# EAGLE schematic STUSB4500_PS (EAGLE 9.5.2)

## Sheet 1 of 4
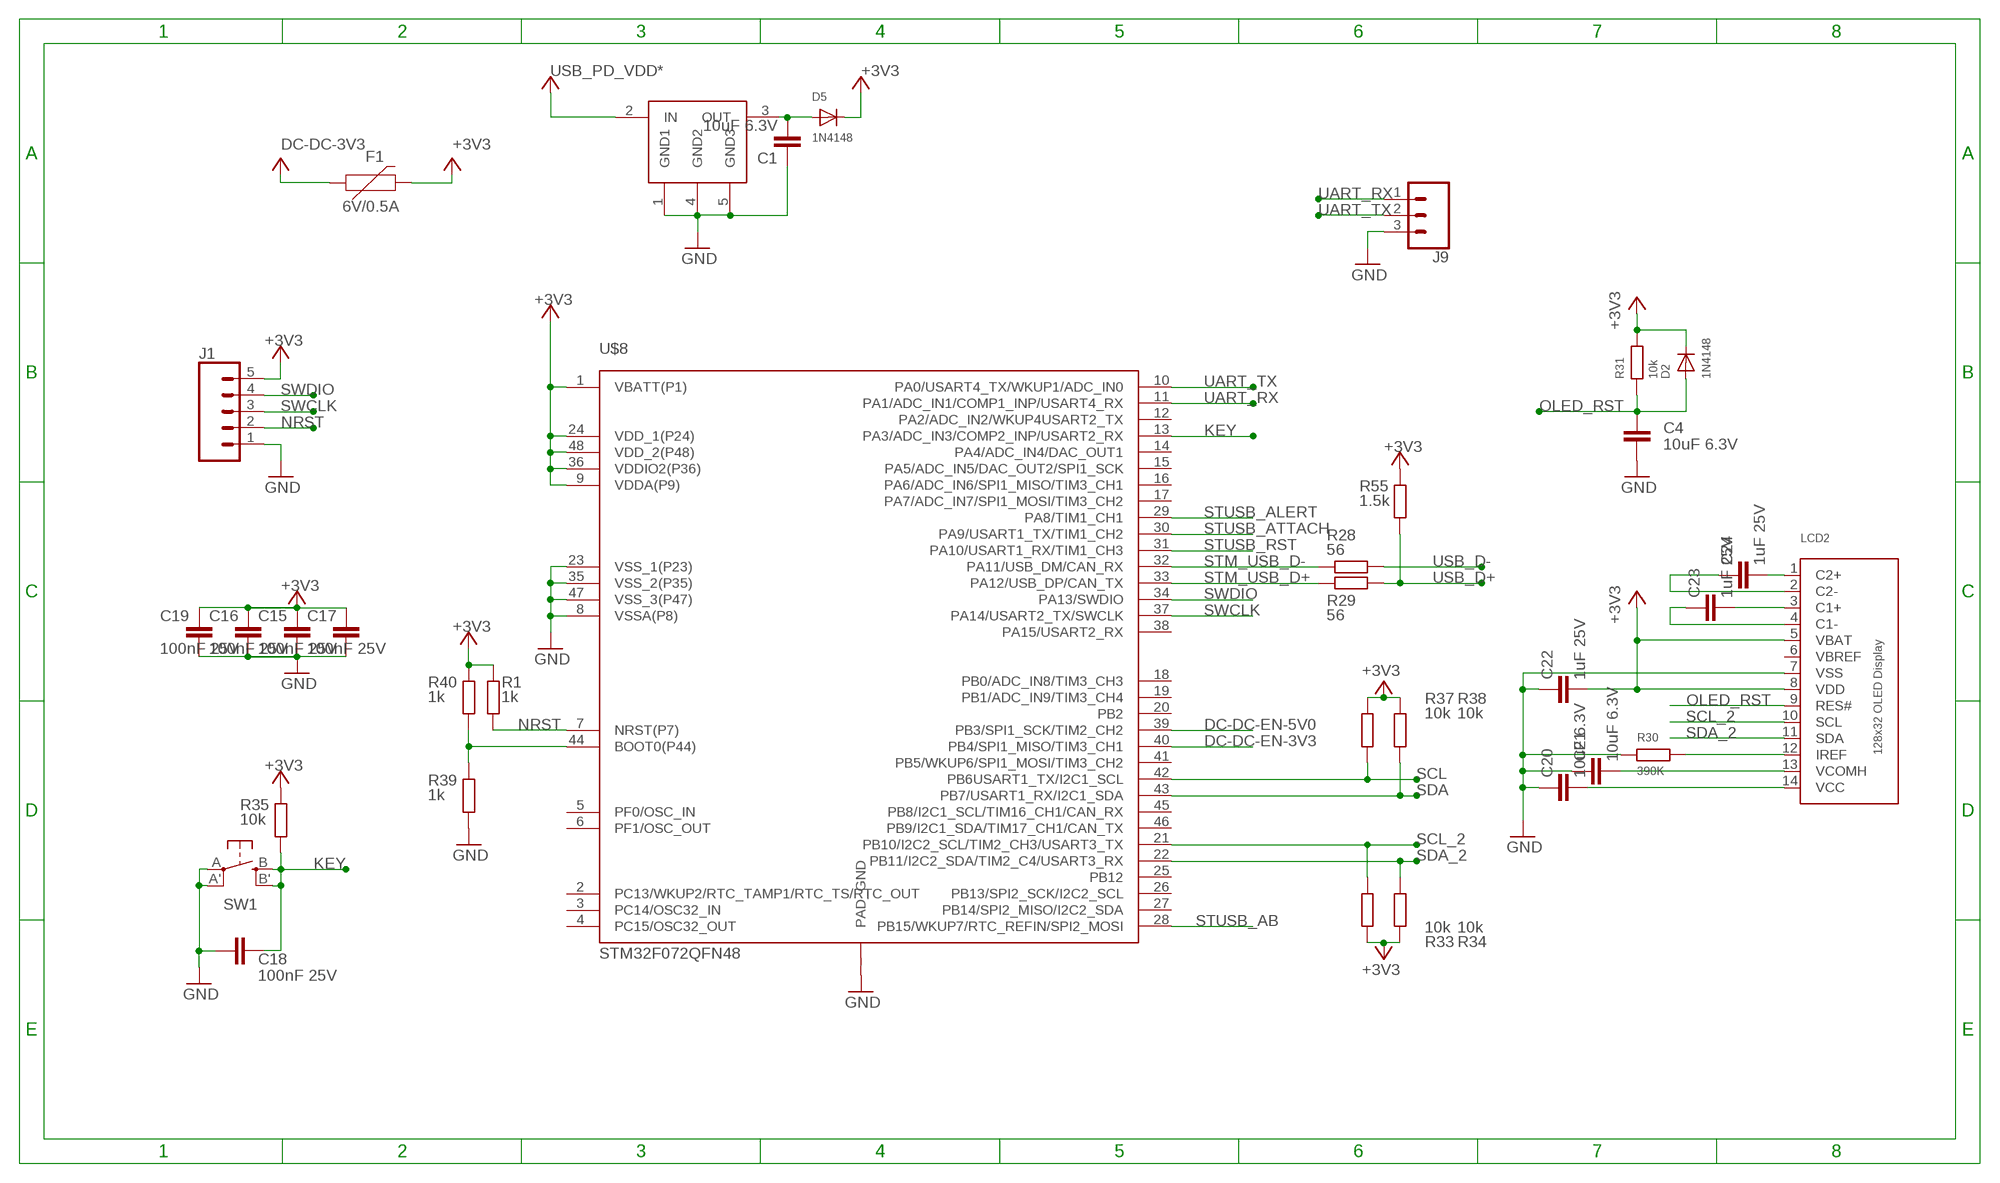
[diagram p0: schematic, sheet 1]

### Parts
C1  10uF 6.3V  C-EUC0603  [C0603]
C4  10uF 6.3V  C-EUC0603  [C0603]
C15  100nF 25V  C-EUC0402  [C0402]
C16  100nF 25V  C-EUC0402  [C0402]
C17  100nF 25V  C-EUC0402  [C0402]
C18  100nF 25V  C-EUC0402  [C0402]
C19  100nF 25V  C-EUC0402  [C0402]
C20  10uF 6.3V  C-EUC0603  [C0603]
C21  10uF 6.3V  C-EUC0603  [C0603]
C22  1uF 25V  C-EUC0603  [C0603]
C23  1uF 25V  C-EUC0603  [C0603]
C24  1uF 25V  C-EUC0603  [C0603]
D2  1N4148  DIODESOD-323F  [SOD-323F]
D5  1N4148  DIODESOD-323F  [SOD-323F]
F1  6V/0.5A  PPTC_HALF-AMP  [1206]
J1  CONN_05LOCK  [1X05_LOCK]
J9  CONN_03LOCK_NO_SILK  [1X03_LOCK_NO_SILK]
LCD2  DISP_OLED_UG-2832HSWEG02  [UG-2832HSWEG02_WRAPUNDER]
R1  1k  R-EU_R0402  [R0402]
R28  56  R-EU_R0402  [R0402]
R29  56  R-EU_R0402  [R0402]
R30  390K  R-EU_R0603  [R0603]
R31  10k  R-EU_R0603  [R0603]
R33  10k  R-EU_R0402  [R0402]
R34  10k  R-EU_R0402  [R0402]
R35  10k  R-EU_R0402  [R0402]
R37  10k  R-EU_R0402  [R0402]
R38  10k  R-EU_R0402  [R0402]
R39  1k  R-EU_R0402  [R0402]
R40  1k  R-EU_R0402  [R0402]
R55  1.5k  R-EU_R0402  [R0402]
SW1  SPST_TACT-EVQQ2  [EVQ-Q2]
U$1  TLV704_3V3SOT23-5  [SOT23-5]
U$8  STM32F072QFN48  [P-HVQFN48-7X7]

### Nets
+3V3: C15.1 C16.1 C17.1 C19.1 C22.2 D2.C D5.C F1.2 J1.5 LCD2.5(VBAT) LCD2.8(VDD) R1.2 R31.2 R33.2 R34.2 R35.2 R37.2 R38.2 R40.2 R55.2 U$8.1(VBATT(P1)) U$8.9(VDDA(P9)) U$8.24(VDD_1(P24)) U$8.36(VDDIO2(P36)) U$8.48(VDD_2(P48)) ; also sheet 2
DC-DC-3V3: F1.1 ; also sheet 2,3
DC-DC-EN-3V3: U$8.40(PB4/SPI1_MISO/TIM3_CH1) ; also sheet 3
DC-DC-EN-5V0: U$8.39(PB3/SPI1_SCK/TIM2_CH2) ; also sheet 3
GND: C1.1 C4.1 C15.2 C16.2 C17.2 C18.1 C19.2 C20.1 C21.1 C22.1 J1.1 J9.3 LCD2.7(VSS) R30.1 R39.1 SW1.A'(P1) SW1.A(P) U$1.1(GND1) U$1.4(GND2) U$1.5(GND3) U$8.8(VSSA(P8)) U$8.23(VSS_1(P23)) U$8.35(VSS_2(P35)) U$8.47(VSS_3(P47)) U$8._(PAD_GND) ; also sheet 2,3,4
KEY: C18.2 R35.1 SW1.B'(S1) SW1.B(S) U$8.13(PA3/ADC_IN3/COMP2_INP/USART2_RX)
N$2: C1.2 D5.A U$1.3(OUT)
N$27: R39.2 R40.1 U$8.44(BOOT0(P44))
N$35: C24.2 LCD2.1(C2+)
N$36: C24.1 LCD2.2(C2-)
N$37: C23.2 LCD2.3(C1+)
N$38: C23.1 LCD2.4(C1-)
N$39: C21.2 LCD2.13(VCOMH)
N$40: LCD2.12(IREF) R30.2
N$41: C20.2 LCD2.14(VCC)
NRST: J1.2 R1.1 U$8.7(NRST(P7))
OLED_RST: C4.2 D2.A LCD2.9(RES#) R31.1
SCL: R37.1 U$8.42(PB6USART1_TX/I2C1_SCL) ; also sheet 4
SCL_2: LCD2.10(SCL) R33.1 U$8.21(PB10/I2C2_SCL/TIM2_CH3/USART3_TX) ; also sheet 2
SDA: R38.1 U$8.43(PB7/USART1_RX/I2C1_SDA) ; also sheet 4
SDA_2: LCD2.11(SDA) R34.1 U$8.22(PB11/I2C2_SDA/TIM2_C4/USART3_RX) ; also sheet 2
STM_USB_D+: R29.1 U$8.33(PA12/USB_DP/CAN_TX)
STM_USB_D-: R28.1 U$8.32(PA11/USB_DM/CAN_RX)
STUSB_AB: U$8.28(PB15/WKUP7/RTC_REFIN/SPI2_MOSI) ; also sheet 4
STUSB_ALERT: U$8.29(PA8/TIM1_CH1) ; also sheet 4
STUSB_ATTACH: U$8.30(PA9/USART1_TX/TIM1_CH2) ; also sheet 4
STUSB_RST: U$8.31(PA10/USART1_RX/TIM1_CH3) ; also sheet 4
SWCLK: J1.3 U$8.37(PA14/USART2_TX/SWCLK)
SWDIO: J1.4 U$8.34(PA13/SWDIO)
UART_RX: J9.1 U$8.11(PA1/ADC_IN1/COMP1_INP/USART4_RX)
UART_TX: J9.2 U$8.10(PA0/USART4_TX/WKUP1/ADC_IN0)
USB_D+: R29.2 R55.1 ; also sheet 4
USB_D-: R28.2 ; also sheet 4
USB_PD_VDD*: U$1.2(IN) ; also sheet 4
Unconnected: U$8.2(PC13/WKUP2/RTC_TAMP1/RTC_TS/RTC_OUT) U$8.3(PC14/OSC32_IN) U$8.4(PC15/OSC32_OUT) U$8.5(PF0/OSC_IN) U$8.6(PF1/OSC_OUT) U$8.12(PA2/ADC_IN2/WKUP4USART2_TX) U$8.14(PA4/ADC_IN4/DAC_OUT1) U$8.15(PA5/ADC_IN5/DAC_OUT2/SPI1_SCK) U$8.16(PA6/ADC_IN6/SPI1_MISO/TIM3_CH1) U$8.17(PA7/ADC_IN7/SPI1_MOSI/TIM3_CH2) U$8.18(PB0/ADC_IN8/TIM3_CH3) U$8.19(PB1/ADC_IN9/TIM3_CH4) U$8.20(PB2) U$8.25(PB12) U$8.26(PB13/SPI2_SCK/I2C2_SCL) U$8.27(PB14/SPI2_MISO/I2C2_SDA) U$8.38(PA15/USART2_RX) U$8.41(PB5/WKUP6/SPI1_MOSI/TIM3_CH2) U$8.45(PB8/I2C1_SCL/TIM16_CH1/CAN_RX) U$8.46(PB9/I2C1_SDA/TIM17_CH1/CAN_TX)

## Sheet 2 of 4
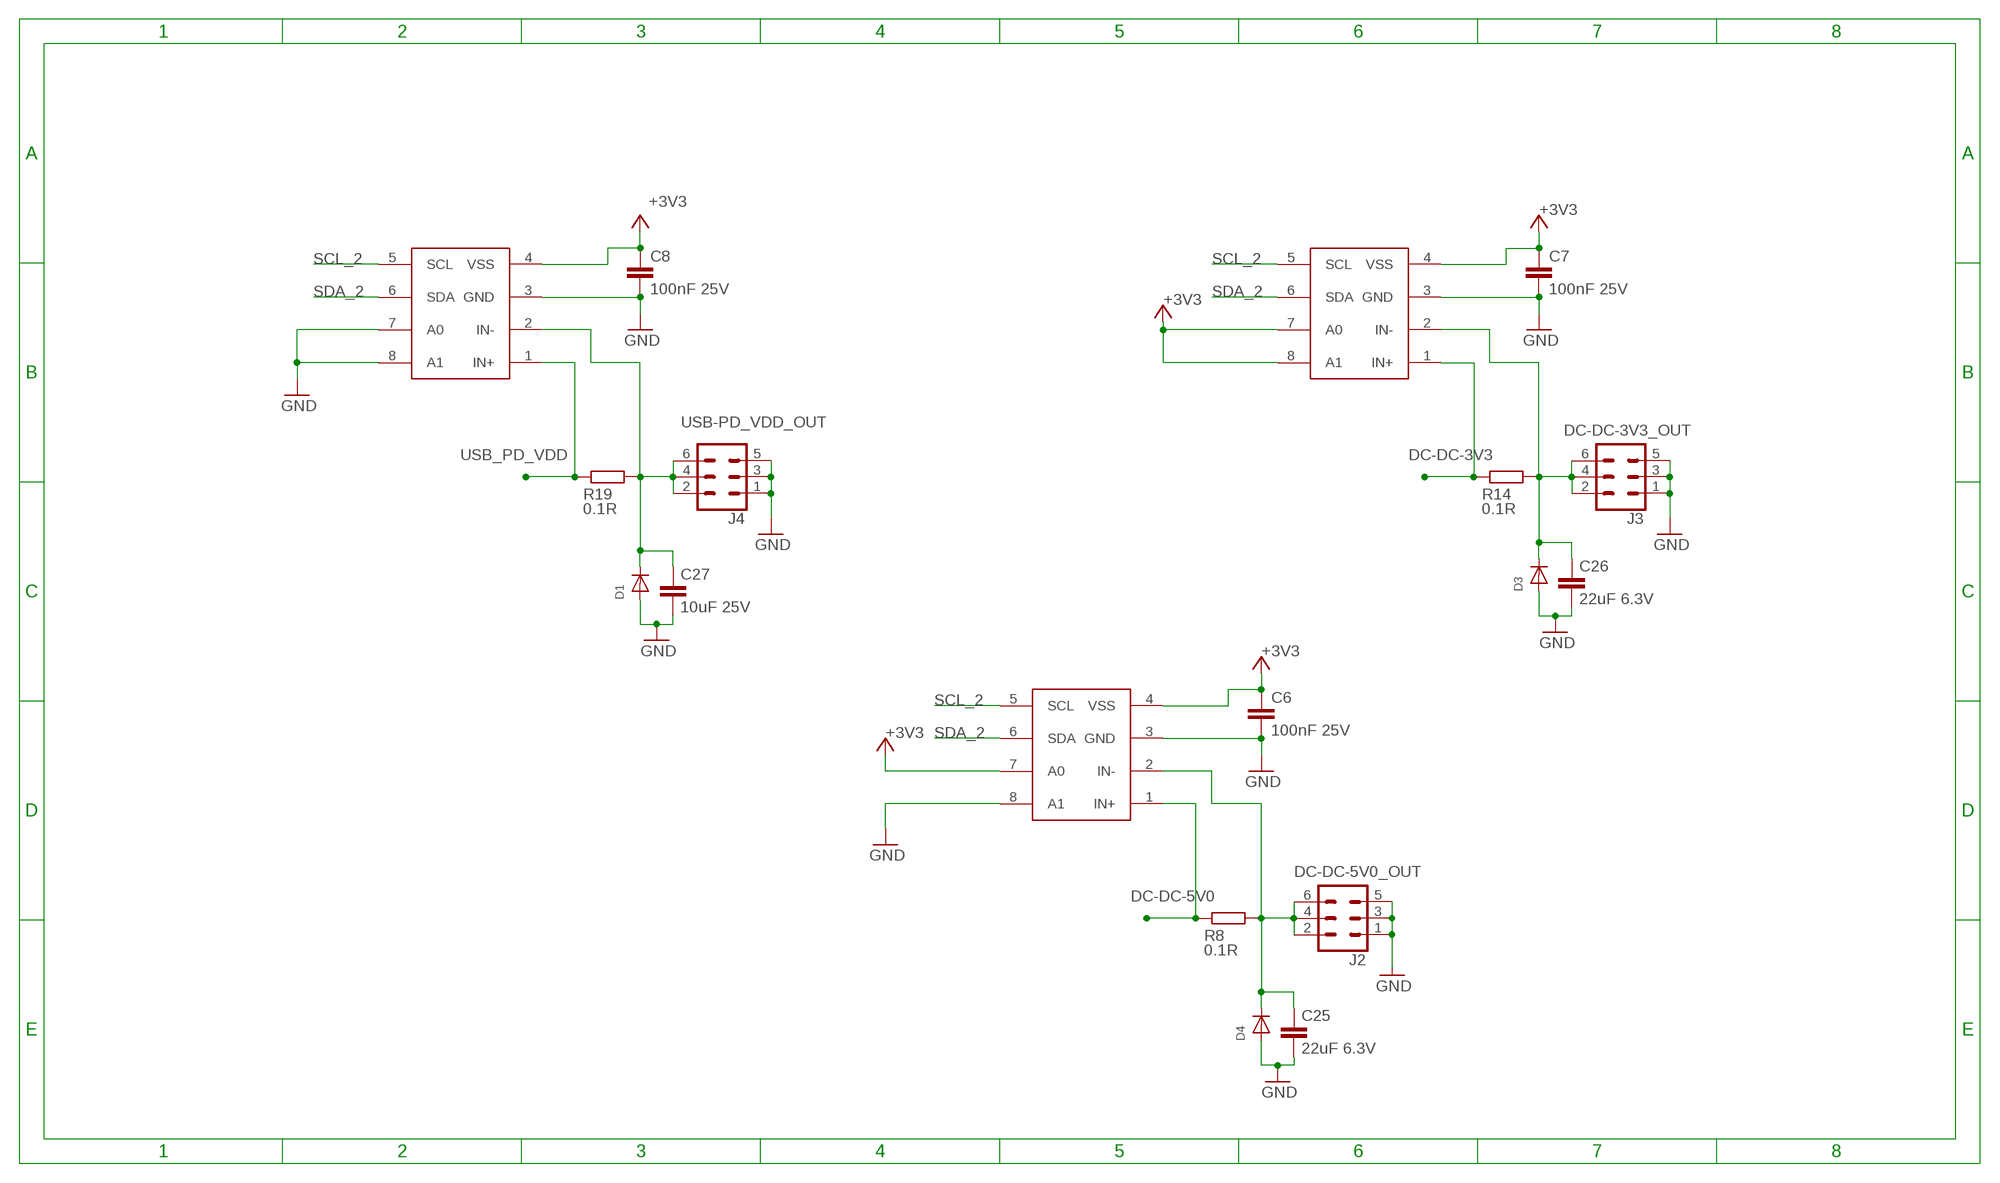
[diagram p1: schematic, sheet 2]

### Parts
C6  100nF 25V  C-EUC0402  [C0402]
C7  100nF 25V  C-EUC0402  [C0402]
C8  100nF 25V  C-EUC0402  [C0402]
C25  22uF 6.3V  C-EUC1206  [C1206]
C26  22uF 6.3V  C-EUC1206  [C1206]
C27  10uF 25V  C-EUC1206  [C1206]
D1  DIODE_SOD-123FL  [SOD-123FL]
D3  DIODE_SOD-123FL  [SOD-123FL]
D4  DIODE_SOD-123FL  [SOD-123FL]
J2  FEMALE 2x3  CONN_03X2NO_SILK  [2X3-NS]
J3  FEMALE 2x3  CONN_03X2NO_SILK  [2X3-NS]
J4  FEMALE 2x3  CONN_03X2NO_SILK  [2X3-NS]
R8  0.1R  R-EU_R2010  [R2010]
R14  0.1R  R-EU_R2010  [R2010]
R19  0.1R  R-EU_R2010  [R2010]
U$7  INA219DCN  [DCN-R-PDSO-G8]
U$9  INA219DCN  [DCN-R-PDSO-G8]
U$10  INA219DCN  [DCN-R-PDSO-G8]

### Nets
+3V3: C6.1 C7.1 C8.1 U$7.4(VSS) U$7.7(A0) U$9.4(VSS) U$9.7(A0) U$9.8(A1) U$10.4(VSS) ; also sheet 1
DC-DC-3V3: R14.2 U$9.1(IN+) ; also sheet 1,3
DC-DC-3V3_OUT: C26.1 D3.C J3.2 J3.4 J3.6 R14.1 U$9.2(IN-)
DC-DC-5V0: R8.2 U$7.1(IN+) ; also sheet 3
DC-DC-5V0_OUT: C25.1 D4.C J2.2 J2.4 J2.6 R8.1 U$7.2(IN-)
GND: C6.2 C7.2 C8.2 C25.2 C26.2 C27.2 D1.A D3.A D4.A J2.1 J2.3 J2.5 J3.1 J3.3 J3.5 J4.1 J4.3 J4.5 U$7.3(GND) U$7.8(A1) U$9.3(GND) U$10.3(GND) U$10.7(A0) U$10.8(A1) ; also sheet 1,3,4
SCL_2: U$7.5(SCL) U$9.5(SCL) U$10.5(SCL) ; also sheet 1
SDA_2: U$7.6(SDA) U$9.6(SDA) U$10.6(SDA) ; also sheet 1
USB-PD_VDD_OUT: C27.1 D1.C J4.2 J4.4 J4.6 R19.1 U$10.2(IN-)
USB_PD_VDD: R19.2 U$10.1(IN+) ; also sheet 3,4

## Sheet 3 of 4
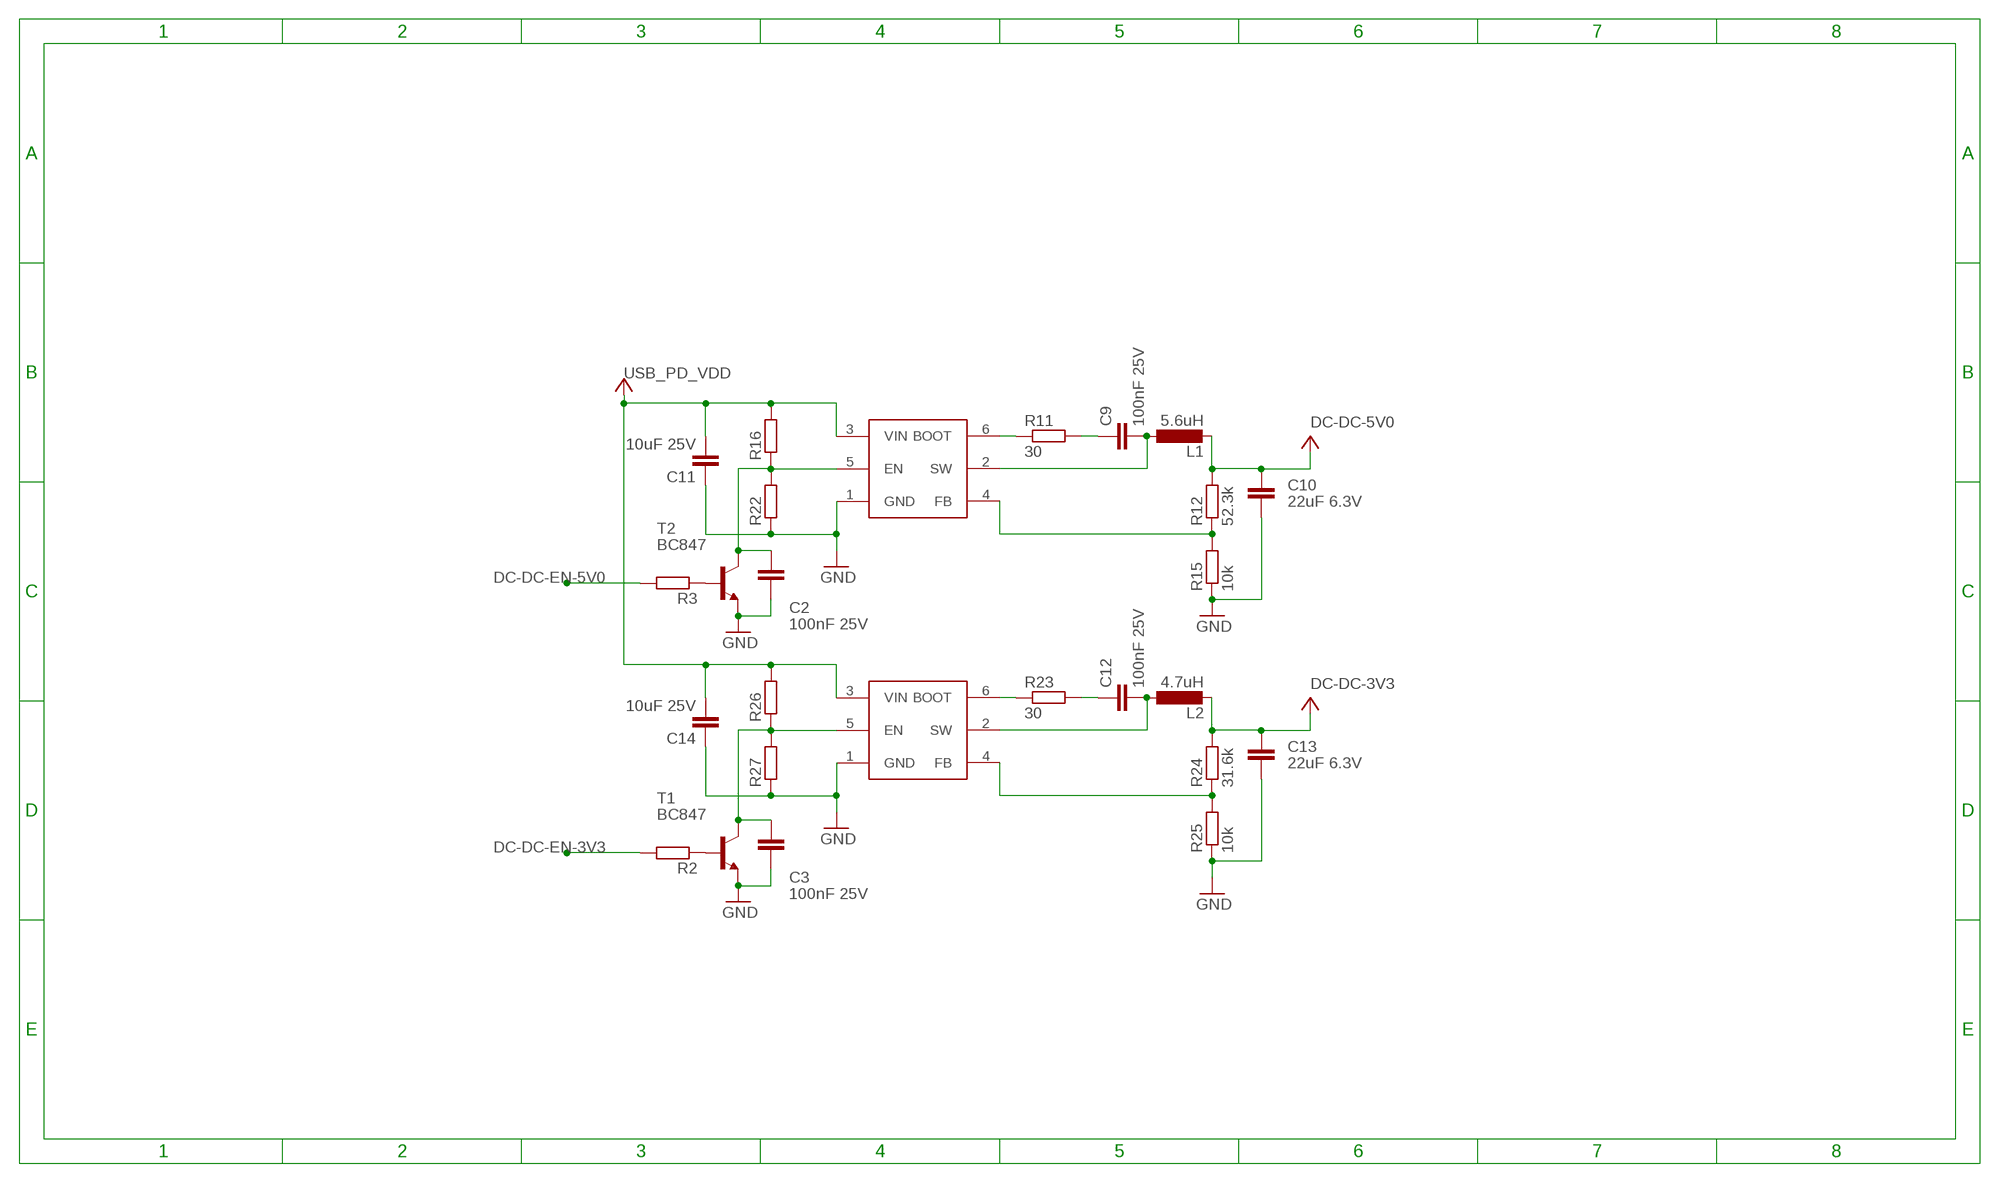
[diagram p2: schematic, sheet 3]

### Parts
C2  100nF 25V  C-EUC0402  [C0402]
C3  100nF 25V  C-EUC0402  [C0402]
C9  100nF 25V  C-EUC0402  [C0402]
C10  22uF 6.3V  C-EUC1206  [C1206]
C11  10uF 25V  C-EUC1206  [C1206]
C12  100nF 25V  C-EUC0402  [C0402]
C13  22uF 6.3V  C-EUC1206  [C1206]
C14  10uF 25V  C-EUC1206  [C1206]
L1  5.6uH  L-EUWE-TPC  [POWER-CHOKE_WE-TPC]
L2  4.7uH  L-EUWE-TPC  [POWER-CHOKE_WE-TPC]
R2  R-EU_R0402  [R0402]
R3  R-EU_R0402  [R0402]
R11  30  R-EU_R0402  [R0402]
R12  52.3k  R-EU_R0603  [R0603]
R15  10k  R-EU_R0603  [R0603]
R16  R-EU_R0402  [R0402]
R22  R-EU_R0402  [R0402]
R23  30  R-EU_R0402  [R0402]
R24  31.6k  R-EU_R0603  [R0603]
R25  10k  R-EU_R0603  [R0603]
R26  R-EU_R0402  [R0402]
R27  R-EU_R0402  [R0402]
T1  BC847  [SOT23]
T2  BC847  [SOT23]
U$11  TPS56339SOT23-6  [TEXAS_SOT23-6]
U$12  TPS56339SOT23-6  [TEXAS_SOT23-6]

### Nets
DC-DC-3V3: C13.2 L2.2 R24.2 ; also sheet 1,2
DC-DC-5V0: C10.2 L1.2 R12.2 ; also sheet 2
DC-DC-EN-3V3: R2.2 ; also sheet 1
DC-DC-EN-5V0: R3.2 ; also sheet 1
GND: C2.1 C3.1 C10.1 C11.1 C13.1 C14.1 R15.1 R22.1 R25.1 R27.1 T1.2(E) T2.2(E) U$11.1(GND) U$12.1(GND) ; also sheet 1,2,4
N$3: R2.1 T1.1(B)
N$5: R3.1 T2.1(B)
N$18: R12.1 R15.2 U$11.4(FB)
N$19: C2.2 R16.1 R22.2 T2.3(C) U$11.5(EN)
N$22: R24.1 R25.2 U$12.4(FB)
N$23: R11.1 U$11.6(BOOT)
N$24: C9.1 R11.2
N$25: C3.2 R26.1 R27.2 T1.3(C) U$12.5(EN)
N$26: C9.2 L1.1 U$11.2(SW)
N$28: R23.1 U$12.6(BOOT)
N$29: C12.1 R23.2
N$30: C12.2 L2.1 U$12.2(SW)
USB_PD_VDD: C11.2 C14.2 R16.2 R26.2 U$11.3(VIN) U$12.3(VIN) ; also sheet 2,4

## Sheet 4 of 4
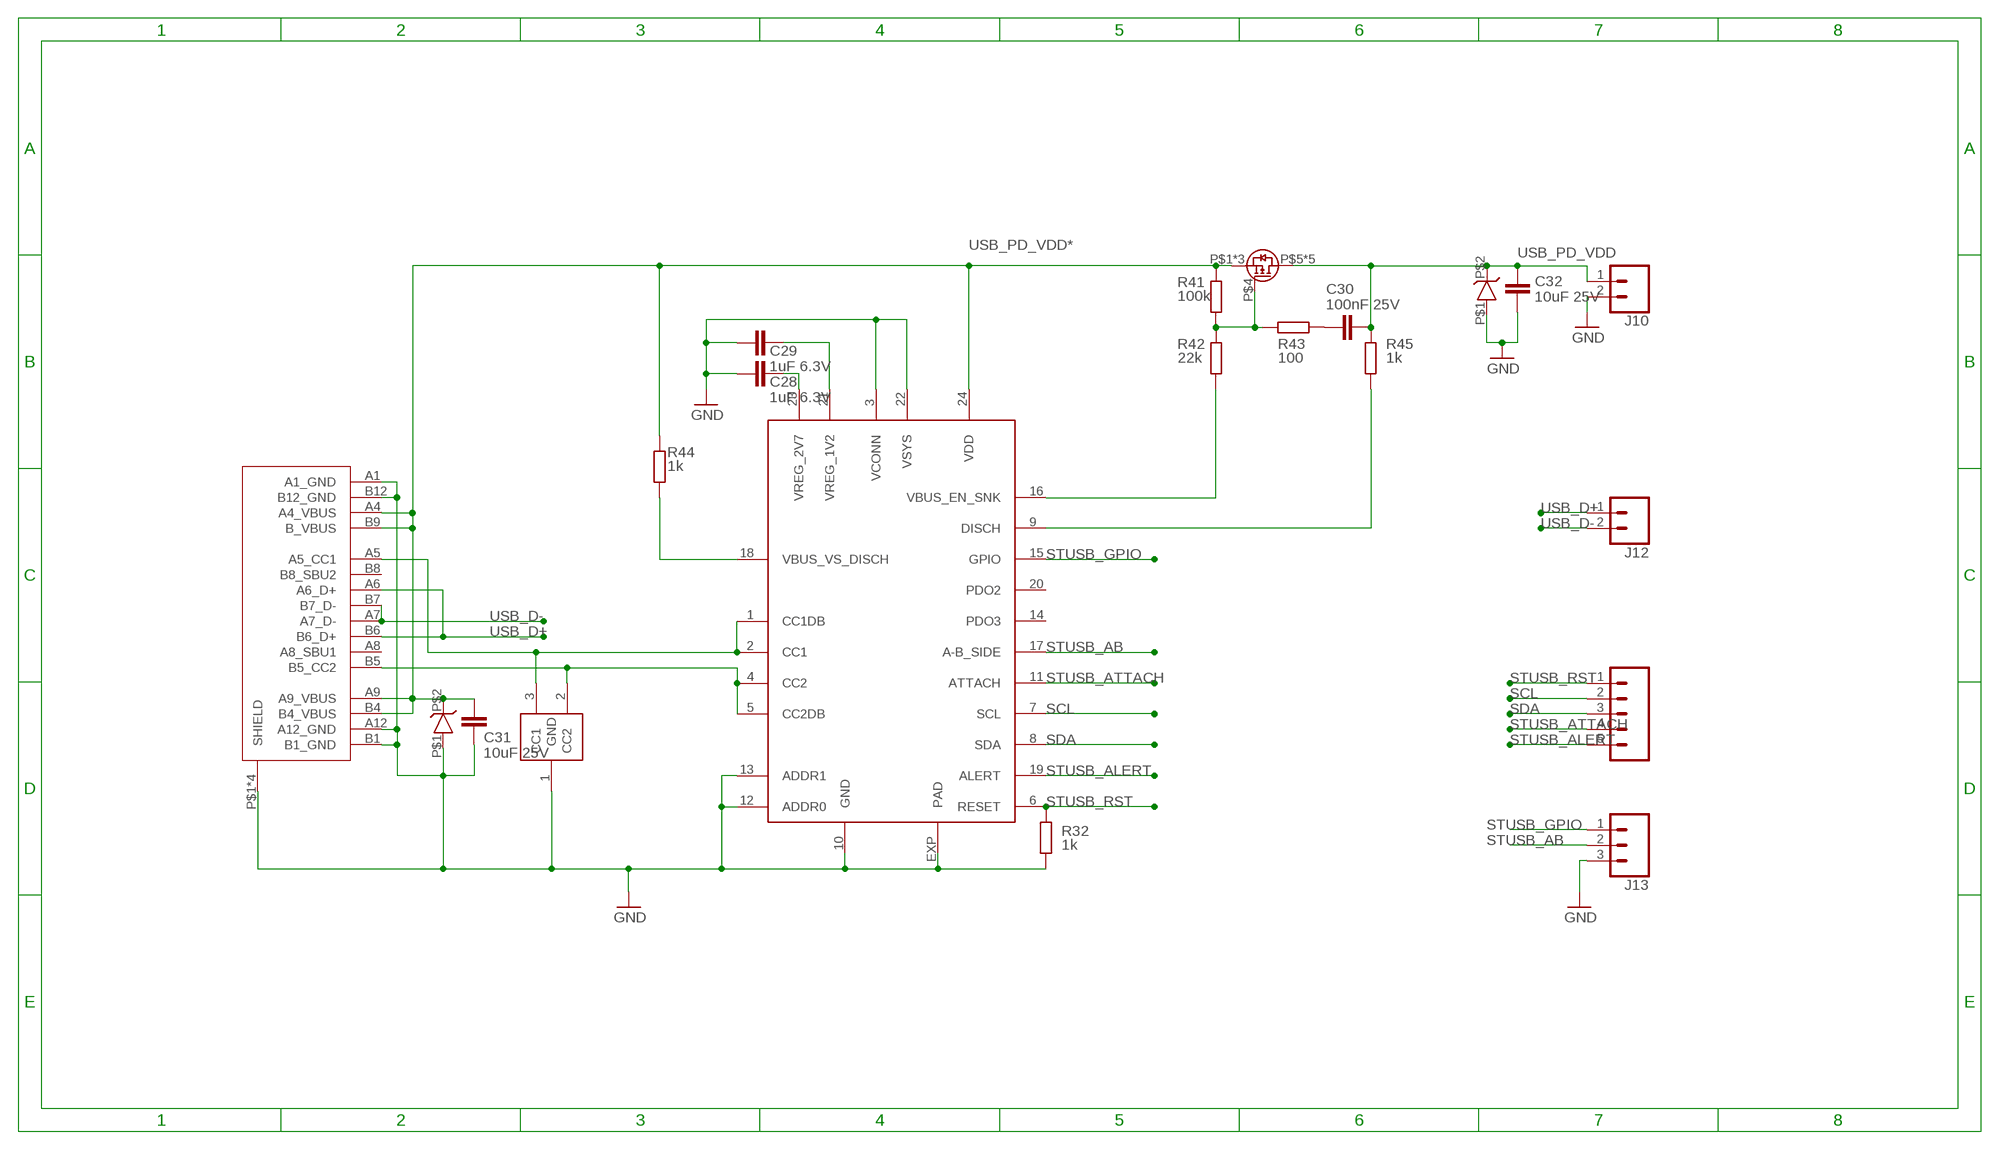
[diagram p3: schematic, sheet 4]

### Parts
C28  1uF 6.3V  C-EUC0402  [C0402]
C29  1uF 6.3V  C-EUC0402  [C0402]
C30  100nF 25V  C-EUC0402  [C0402]
C31  10uF 25V  C-EUC1206  [C1206]
C32  10uF 25V  C-EUC1206  [C1206]
ESDA25W1  ESDA25WSOT323  [SOT323]
J10  CONN_02LOCK  [1X02_LOCK]
J11  CONN_051.27MM  [1X05_1.27MM]
J12  CONN_021.27  [1X02_1.27MM]
J13  CONN_031.27  [1X03_1.27MM]
R32  1k  R-EU_R0402  [R0402]
R41  100k  R-EU_R0402  [R0402]
R42  22k  R-EU_R0402  [R0402]
R43  100  R-EU_R0402  [R0402]
R44  1k  R-EU_R0402  [R0402]
R45  1k  R-EU_R0402  [R0402]
U$3  STUSB4500QFN24_4X4  [QFN24-4X4]
U$13  USB-C  [USB-C_16P]
U$14  ESDA25P35  [1610]
U$15  ESDA25P35  [1610]
U$16  STL6P3LLH6  [POWER_FLAT_3X3]

### Nets
GND: C28.2 C29.2 C31.2 C32.2 ESDA25W1.1(GND) J10.2 J13.3 R32.1 U$3.3(VCONN) U$3.10(GND) U$3.12(ADDR0) U$3.13(ADDR1) U$3.22(VSYS) U$3.EXP(PAD) U$13.A1(A1_GND) U$13.A12(A12_GND) U$13.B1(B1_GND) U$13.B12(B12_GND) U$13.P$1(SHIELD) U$13.P$2(SHIELD) U$13.P$3(SHIELD) U$13.P$4(SHIELD) U$14.P$1(GND) U$15.P$1(GND) ; also sheet 1,2,3
N$21: R41.1 R42.2 R43.2 U$16.P$4(G)
N$31: R44.2 U$3.18(VBUS_VS_DISCH)
N$32: ESDA25W1.3(CC1) U$3.1(CC1DB) U$3.2(CC1) U$13.A5(A5_CC1)
N$33: ESDA25W1.2(CC2) U$3.4(CC2) U$3.5(CC2DB) U$13.B5(B5_CC2)
N$34: R42.1 U$3.16(VBUS_EN_SNK)
N$42: C30.1 R43.1
N$43: R45.2 U$3.9(DISCH)
N$44: C28.1 U$3.23(VREG_2V7)
N$45: C29.1 U$3.21(VREG_1V2)
SCL: J11.2 U$3.7(SCL) ; also sheet 1
SDA: J11.3 U$3.8(SDA) ; also sheet 1
STUSB_AB: J13.2 U$3.17(A-B_SIDE) ; also sheet 1
STUSB_ALERT: J11.5 U$3.19(ALERT) ; also sheet 1
STUSB_ATTACH: J11.4 U$3.11(ATTACH) ; also sheet 1
STUSB_GPIO: J13.1 U$3.15(GPIO)
STUSB_RST: J11.1 R32.2 U$3.6(RESET) ; also sheet 1
USB_D+: J12.1 U$13.A6(A6_D+) U$13.B6(B6_D+) ; also sheet 1
USB_D-: J12.2 U$13.A7(A7_D-) U$13.B7(B7_D-) ; also sheet 1
USB_PD_VDD: C30.2 C32.1 J10.1 R45.1 U$15.P$2(VBUS) U$16.P$5(D) U$16.P$6(D) U$16.P$7(D) U$16.P$8(D) U$16.P$9(D) ; also sheet 2,3
USB_PD_VDD*: C31.1 R41.2 R44.1 U$3.24(VDD) U$13.A4(A4_VBUS) U$13.A9(A9_VBUS) U$13.B4(B4_VBUS) U$13.B9(B_VBUS) U$14.P$2(VBUS) U$16.P$1(S) U$16.P$2(S) U$16.P$3(S) ; also sheet 1
Unconnected: U$3.14(PDO3) U$3.20(PDO2) U$13.A8(A8_SBU1) U$13.B8(B8_SBU2)

## Power pins joined to a net without a drawn wire
VBREF: LCD2.6(VBREF)

## Library data of the parts
C1-C4 C6-C32 = DD_rcl:C-EU: CAPACITOR, European symbol; SPICEPREFIX: C
D1-D5 = DD_adafruit:DIODE: Diode SMADIODE - SMA Surface Mount Package 20V 1A Schottky Diode Digikey: 641-1014-6-ND DO-1N4148 - Through Hole Small Current Diode SOD-123 20V 1 A (.5mV Vf) Schottky Diode - Digikey: MBRX120TPMSCT-ND SOD-323 10V 570mA (.38mV Vf, 3ns) Schottky Diode - Digikey: ZLLS410CT-ND SOD-523 30V 30mA Schottky Diode (RB751S-40TE61) - Digikey: RB751S-40TE61CT-ND SOT23-R/W - SOT23 Package (R = Solder Paste/Reflow Ovens, W = Hand-Soldering) BAT54Film 40V 300mA - Digikey: 497-7162-1-ND
ESDA25W1 = DD_STUSB4500:ESDA25W
F1 = DD_SparkFun-Fuses:PPTC: Resettable Fuse PPTC Resettable Fuse. Really a sort of resistor with a polymeric positive temperature coefficient whose resistance increases dramatically with an increase in temperature. When heated by the power passing through the resistance rises causing the current to be limited, protecting the circuit. This is achieved by the transition of the polymer from a crystalline to an amorphous state where the conductive carbon separates breaking the conductive pathways found in the cool crystalline structure. When a PPTC cools back down it resumes conducting letting the circuit turn back on. SparkFun Products: SparkFun RedBoard - Programmed with Arduino <https://www.sparkfun.com/products/12757> Pro Micro - 5V/16MHz <https://www.sparkfun.com/products/12640> Arduino Pro 328 - 5V/16MHz <https://www.sparkfun.com/products/10915> MP3 Trigger <https://www.sparkfun.com/products/13720>; PROD_ID: RES-08585
J1 J11 = DD_SparkFun-Connectors:CONN_05: Multi connection point. Often used as Generic Header-pin footprint for 0.1 inch spaced/style header connections On any of the 0.1 inch spaced packages, you can populate with these: Break Away Headers - Straight <https://www.sparkfun.com/products/116> (PRT-00116) Break Away Male Headers - Right Angle <https://www.sparkfun.com/products/553> (PRT-00553) Female Headers <https://www.sparkfun.com/products/115> (PRT-00115) Break Away Headers - Machine Pin <https://www.sparkfun.com/products/117> (PRT-00117) Break Away Female Headers - Swiss Machine Pin <https://www.sparkfun.com/products/743> (PRT-00743) For SCREWTERMINALS and SPRING TERMINALS visit here: Screw Terimnals on SparkFun.com <https://www.sparkfun.com/search/results?term=Screw+Terminals> (5mm/3.5mm/2.54mm spacing) This device is also useful as a general connection point to wire up your design to another part of your project. Our various solder wires solder well into these plated through hole pads. Hook-Up Wire - Assortment (Stranded, 22 AWG) <https://www.sparkfun.com/products/11375> (PRT-11375) Hook-Up Wire - Assortment (Solid Core, 22 AWG) <https://www.sparkfun.com/products/11367> (PRT-11367) View the entire wire category on our website here <https://www.sparkfun.com/categories/141> Special notes: Molex polarized connector foot print use with SKU : PRT-08231 with associated crimp pins and housings. 1MM SMD Version SKU: PRT-10208
J2-J4 = DD_SparkFun-Connectors:CONN_03X2: Multi connection point. Often used as Generic Header-pin footprint for 0.1 inch spaced/style header connections You can populate with any combo of single row headers, but if you'd like an exact match, check these: Header - 2x3 (Male, 0.1") <https://www.sparkfun.com/products/12807> (PRT-12807) Header - 2x3 (Female, 0.1") <https://www.sparkfun.com/products/13010> (PRT-13010) 2x3 Pin Shrouded Header <https://www.sparkfun.com/products/10877> (PRT-10877) On any of the 0.1 inch spaced packages, you can populate with these: Break Away Headers - Straight <https://www.sparkfun.com/products/116> (PRT-00116) Break Away Male Headers - Right Angle <https://www.sparkfun.com/products/553> (PRT-00553) Female Headers <https://www.sparkfun.com/products/115> (PRT-00115) Break Away Headers - Machine Pin <https://www.sparkfun.com/products/117> (PRT-00117) Break Away Female Headers - Swiss Machine Pin <https://www.sparkfun.com/products/743> (PRT-00743) Special note: the shrouded connector mates well with our 3x2 ribbon cables: Ribbon Crimp Connector - 6-pin (2x3, Female) <https://www.sparkfun.com/products/10651> (PRT-10651) Ribbon Cable - 6 wire (15ft) <https://www.sparkfun.com/products/10646> (PRT-10646)
J9 J13 = DD_SparkFun-Connectors:CONN_03: Multi connection point. Often used as Generic Header-pin footprint for 0.1 inch spaced/style header connections On any of the 0.1 inch spaced packages, you can populate with these: Break Away Headers - Straight <https://www.sparkfun.com/products/116> (PRT-00116) Break Away Male Headers - Right Angle <https://www.sparkfun.com/products/553> (PRT-00553) Female Headers <https://www.sparkfun.com/products/115> (PRT-00115) Break Away Headers - Machine Pin <https://www.sparkfun.com/products/117> (PRT-00117) Break Away Female Headers - Swiss Machine Pin <https://www.sparkfun.com/products/743> (PRT-00743) Stackable Header - 3 Pin (Female, 0.1") <https://www.sparkfun.com/products/13875> (PRT-13875) For SCREWTERMINALS and SPRING TERMINALS visit here: Screw Terimnals on SparkFun.com <https://www.sparkfun.com/search/results?term=Screw+Terminals> (5mm/3.5mm/2.54mm spacing) This device is also useful as a general connection point to wire up your design to another part of your project. Our various solder wires solder well into these plated through hole pads. Hook-Up Wire - Assortment (Stranded, 22 AWG) <https://www.sparkfun.com/products/11375> (PRT-11375) Hook-Up Wire - Assortment (Solid Core, 22 AWG) <https://www.sparkfun.com/products/11367> (PRT-11367) View the entire wire category on our website here <https://www.sparkfun.com/categories/141> Special notes: Molex polarized connector foot print use with SKU : PRT-08232 with associated crimp pins and housings.
J10 J12 = DD_SparkFun-Connectors:CONN_02: Multi connection point. Often used as Generic Header-pin footprint for 0.1 inch spaced/style header connections On any of the 0.1 inch spaced packages, you can populate with these: Break Away Headers - Straight <https://www.sparkfun.com/products/116> (PRT-00116) Break Away Male Headers - Right Angle <https://www.sparkfun.com/products/553> (PRT-00553) Female Headers <https://www.sparkfun.com/products/115> (PRT-00115) Break Away Headers - Machine Pin <https://www.sparkfun.com/products/117> (PRT-00117) Break Away Female Headers - Swiss Machine Pin <https://www.sparkfun.com/products/743> (PRT-00743) For SCREWTERMINALS and SPRING TERMINALS visit here: Screw Terimnals on SparkFun.com <https://www.sparkfun.com/search/results?term=Screw+Terminals> (5mm/3.5mm/2.54mm spacing) This device is also useful as a general connection point to wire up your design to another part of your project. Our various solder wires solder well into these plated through hole pads. Hook-Up Wire - Assortment (Stranded, 22 AWG) <https://www.sparkfun.com/products/11375> (PRT-11375) Hook-Up Wire - Assortment (Solid Core, 22 AWG) <https://www.sparkfun.com/products/11367> (PRT-11367) View the entire wire category on our website here <https://www.sparkfun.com/categories/141> Special notes: Molex polarized connector foot print use with: PRT-08233 with associated crimp pins and housings. 2.54_SCREWTERM for use with PRT-10571. 3.5mm Screw Terminal footprints for PRT-08084 5mm Screw Terminal footprints for use with PRT-08432
L1 L2 = DD_rcl:L-EU: INDUCTOR, European symbol; SPICEPREFIX: L
LCD2 = DD_microbuilder:DISP_OLED_UG-2832HSWEG02: 128x32 I2C 0.91" Monochrome OLED Display
R1-R3 R8 R11 R12 R14-R16 R19 R22-R35 R37-R45 R55 = DD_rcl:R-EU_: RESISTOR, European symbol; SPICEPREFIX: R
SW1 = DD_adafruit:SPST_TACT: SMT 6mm switch, EVQQ2 series http://www.ladyada.net/library/eagle
T1 T2 = transistor:BC847: NPN TRANSISTOR
U$1 = DD_TLV704:TLV704_3V3
U$3 = DD_STUSB4500:STUSB4500
U$7 U$9 U$10 = DD_INA219:INA219
U$8 = DD_stm32f0:STM32F072
U$11 U$12 = DD_TPS56339:TPS56339
U$13 = DD_usb_c:USB-C
U$14 U$15 = DD_STUSB4500:ESDA25P35
U$16 = DD_STUSB4500:STL6P3LLH6

## Net classes
0 default: clearance 0.205 mm